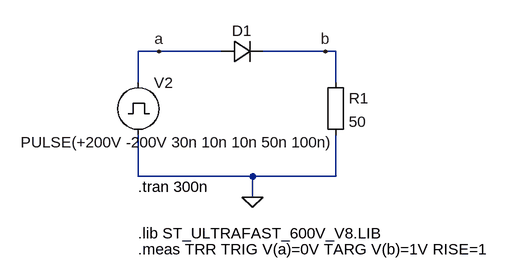
[diagram p0: schematic TRR-ST-TURBO-1.asc]
TRR-ST-TURBO-1.asc, the LTspice schematic file:
Version 4
SHEET 1 880 680
WIRE -176 80 -208 80
WIRE -80 80 -176 80
WIRE 80 80 -16 80
WIRE 96 80 80 80
WIRE -208 128 -208 80
WIRE 96 128 96 80
WIRE -208 272 -208 208
WIRE -32 272 -208 272
WIRE 96 272 96 208
WIRE 96 272 -32 272
WIRE -32 304 -32 272
FLAG -32 304 0
FLAG 80 80 b
FLAG -176 80 a
SYMBOL Misc\\EuropeanResistor 80 112 R0
SYMATTR InstName R1
SYMATTR Value 50
SYMBOL pulse -208 112 R0
WINDOW 3 -181 108 Left 2
WINDOW 123 0 0 Left 0
WINDOW 39 0 0 Left 0
SYMATTR Value PULSE(+200V -200V 30n 10n 10n 50n 100n)
SYMATTR InstName V2
SYMBOL STTH2R06RL -80 96 R270
WINDOW 0 32 32 VTop 2
WINDOW 3 0 32 VBottom 2
SYMATTR InstName D1
SYMATTR Value ""
TEXT -208 288 Left 2 !.tran 300n
TEXT -208 384 Left 2 !.meas TRR TRIG V(a)=0V TARG V(b)=1V RISE=1
TEXT -208 360 Left 2 !.lib ST_ULTRAFAST_600V_V8.LIB

The netlist it stands for:
* TRR-ST-TURBO-1.asc
R1 b 0 50
V2 a 0 PULSE(+200V -200V 30n 10n 10n 50n 100n)
D1 a b STTH2R06RL
.model D D
.lib standard.dio
.tran 300n
.meas TRR TRIG V(a)=0V TARG V(b)=1V RISE=1
.lib ST_ULTRAFAST_600V_V8.LIB
.backanno
.end